# Altium schematic sheet AC Voltage Sampling.SchDoc
size A4
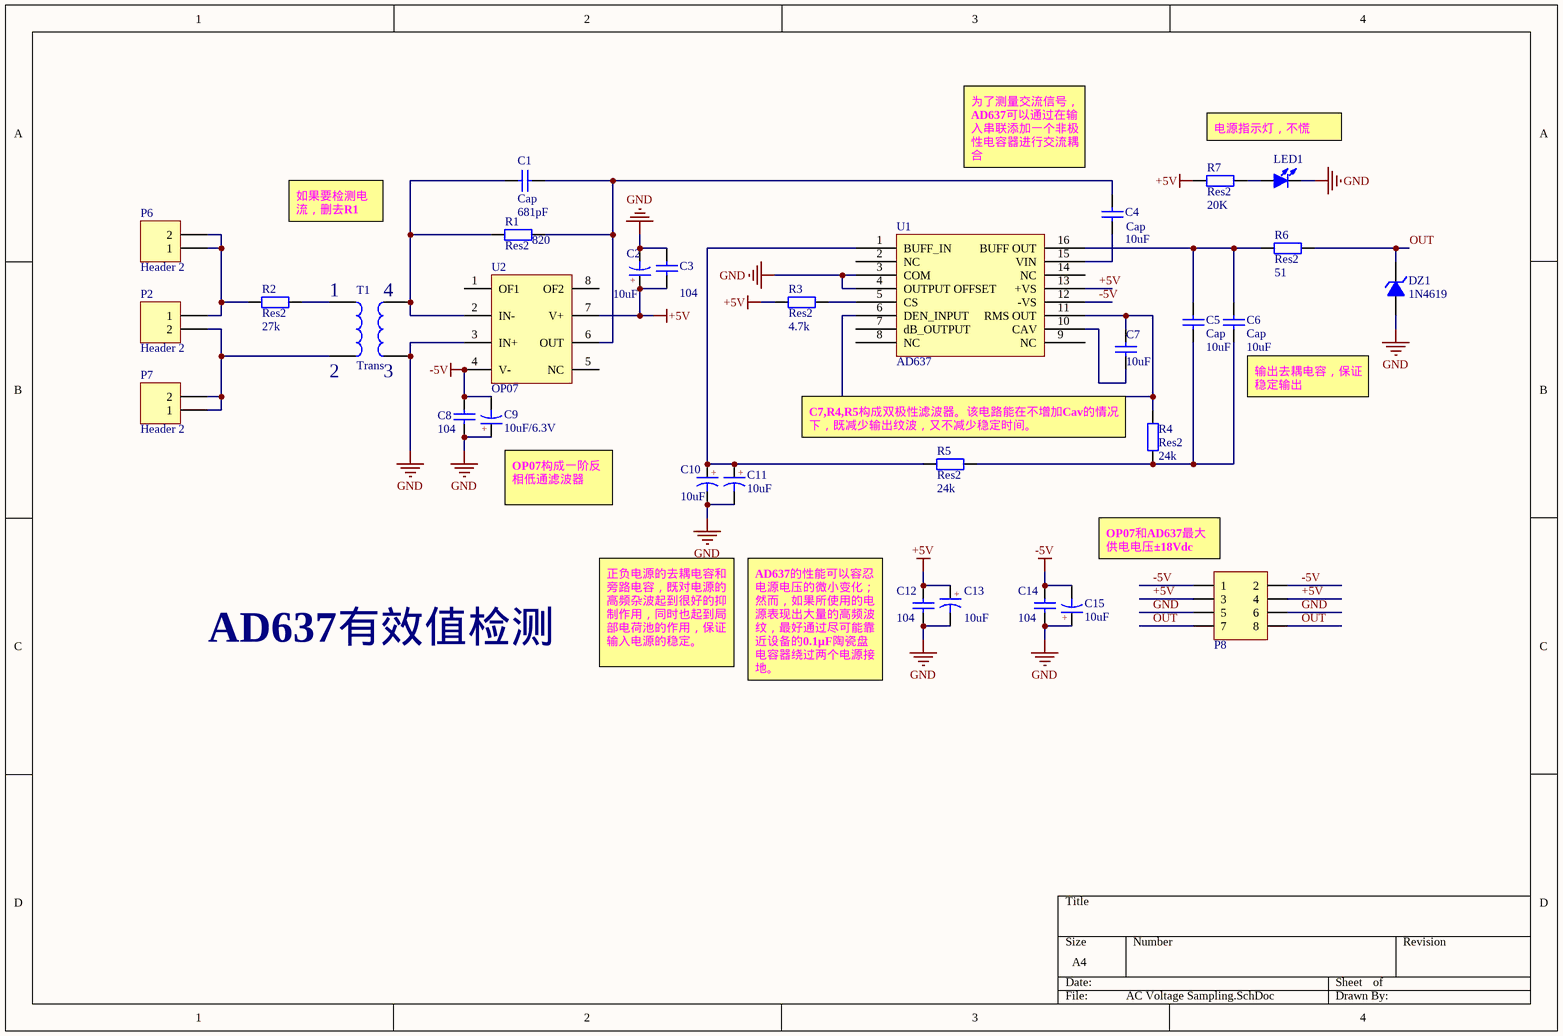
[diagram p0: AC Voltage Sampling.SchDoc]

## Parts
C1  Cap  value 681pF  [C0805_L]
C2  10uF  [C_3528]
C3  value 104  [C0805_L]  (hidden comment: Cap)
C4  Cap  value 10uF  [C0805_L]
C5  Cap  value 10uF  [C0805_L]
C6  Cap  value 10uF  [C0805_L]
C7  value 10uF  [C0805_L]  (hidden comment: Cap)
C8  value 104  [C0805_L]  (hidden comment: Cap)
C9  10uF/6.3V  [C_3528]
C10  10uF  [C_3528]
C11  10uF  [C_3528]
C12  value 104  [C0805_L]  (hidden comment: Cap)
C13  10uF  [C_3528]
C14  value 104  [C0805_L]  (hidden comment: Cap)
C15  10uF  [C_3528]
DZ1  1N4619  [SOD80]
LED1  (no value)  [LED0805_G]
P2  Header 2  [KF301-5.0-2P]
P6  Header 2  [HDR2.54-LI-2P]
P7  Header 2  [HDR2.54-LI-2P]
P8  Header 4X2  [HDR2.54-LI-2x4P]  (value not drawn)
R1  Res2  value 820  [R0805_L]
R2  Res2  value 27k  [R0805_L]
R3  Res2  value 4.7k  [R0805_L]
R4  Res2  value 24k  [R0805_L]
R5  Res2  value 24k  [R0805_L]
R6  Res2  value 51  [R0805_L]
R7  Res2  value 20K  [R0805_L]
T1  Trans  [TV1013]
U1  AD637  [SOIC-16W]
U2  OP07  [SOP8]

## Nets
+5V: C2.1(A) C3.1 C12.1 C13.1(A) P8.3 P8.4 R3.1 R7.1 U1.13(+VS) U2.7(V+)
-5V: C8.2 C9.2(K) C14.1 C15.2(K) P8.1 P8.2 U1.12(-VS) U2.4(V-)
GND: C2.2(K) C3.2 C8.1 C9.1(A) C10.2(K) C11.2(K) C12.2 C13.2(K) C14.2 C15.1(A) DZ1.1(A) LED1.2(K) P8.5 P8.6 T1.4 U1.3(COM) U1.4(OUTPUT_OFFSET) U2.3(IN+)
OUT: DZ1.2(K) P8.7 P8.8 R6.2
NetC1_1: C1.1 R1.2 T1.3 U2.2(IN-)
NetC1_2: C1.2 C4.1 R1.1 U2.6(OUT)
NetC4_2: C4.2 U1.15(VIN)
NetC5_1: C5.1 C6.1 R4.1 R5.2
NetC5_2: C5.2 C6.2 R6.1 U1.16(BUFF_OUT)
NetC7_1: C7.1 U1.10(CAV)
NetC7_2: C7.2 R4.2 U1.6(DEN_INPUT) U1.11(RMS_OUT)
NetC10_1: C10.1(A) C11.1(A) R5.1 U1.1(BUFF_IN)
NetLED1_1: LED1.1(A) R7.2
NetP2_1: P2.1 P6.1 P6.2 R2.1
NetP2_2: P2.2 P7.1 P7.2 T1.2
NetR2_2: R2.2 T1.1
NetR3_2: R3.2 U1.5(CS)

Not connected (* = marked no-connect by the designer): U1 2(NC) 7(dB_OUTPUT) 8(NC) 9(NC) 14(NC); U2 1(OF1) 5(NC) 8(OF2)

## Notes on the sheet
- (near C4) 为了测量交流信号，AD637可以通过在输入串联添加一个非极性电容器进行交流耦合
- 电源指示灯，不慌
- 如果要检测电流，删去R1
- (near T1) 1
- (near T1) 4
- (near T1) 2
- (near T1) 3
- C7,R4,R5构成双极性滤波器。该电路能在不增加Cav的情况下，既减少输出纹波，又不减少稳定时间。
- (near C6) 输出去耦电容，保证稳定输出
- OP07构成一阶反相低通滤波器
- (near P8) OP07和AD637最大供电电压±18Vdc
- AD637有效值检测
- 正负电源的去耦电容和旁路电容，既对电源的高频杂波起到很好的抑制作用，同时也起到局部电荷池的作用，保证输入电源的稳定。
- (near C12) AD637的性能可以容忍电源电压的微小变化；然而，如果所使用的电源表现出大量的高频波纹，最好通过尽可能靠近设备的0.1μF陶瓷盘电容器绕过两个电源接地。
- (in symbol CT) +

## Library data of the parts
C1 C3-C8 C12 C14 = Cap: Capacitor; Published: 8-Jun-2000; LatestRevisionDate: 17-Jul-2002; LatestRevisionNote: Re-released for DXP Platform.; PackageReference: RAD-0.3; Publisher: Altium Limited; PackageDescription: Radial Cap, Thru-Hole; 2 Leads; 0.3 in Pin Spacing
C2 C9-C11 C13 C15 = CT: 贴片钽电容; 联系卖家，免费查找封装: 唯一出售店铺网址https://shop463601444.taobao.com; 封装库来自淘宝卖家ID：黄晶宝石: 其他店铺购入均为盗版假冒封装库，请立即申请退款; BOM名称: 贴片钽电容
DZ1 = 1N4619: 3V/0.5W稳压管; 联系卖家，免费查找封装: 唯一出售店铺网址https://shop463601444.taobao.com; BOM名称: 3V/0.5W稳压管
LED1 = LED-SMD: 贴片LED; 封装库来自淘宝卖家 ID：黄晶宝石: 其他店铺购入均为假冒，请立即申请退款，本店奖励现金5~20元; BOM名称: 贴片LED
P2 P6 P7 = Header 2: Header, 2-Pin; LatestRevisionDate: 17-Jul-2002; LatestRevisionNote: Re-released for DXP Platform.; Publisher: Altium Limited
P8 = Header 4X2: 4*2P接插件; 封装库来自淘宝卖家 ID：黄晶宝石: 其他店铺购入均为盗版假冒封装库; 联系卖家，免费查找封装: 唯一出售店铺网址https://shop463601444.taobao.com; BOM名称: 4*2P接插件
R1-R7 = Res2: Resistor; Published: 8-Jun-2000; LatestRevisionDate: 17-Jul-2002; LatestRevisionNote: Re-released for DXP Platform.; PackageReference: AXIAL-0.4; Publisher: Altium Limited; PackageDescription: Axial Device, Thru-Hole; 2 Leads; 0.4 in Pin Spacing
T1 = Trans: Transformer; Published: 24-Mar-1999; LatestRevisionDate: 08-Jul-2005; LatestRevisionNote: Mech Layer 1 removed.; PackageReference: TRANS; Publisher: Altium Limited; PackageDescription: Transformer; 4 Leads
U1 = AD637(16p): 16脚贴片